# EAGLE board rev1 (EAGLE 9.5.2), part 1 of 2
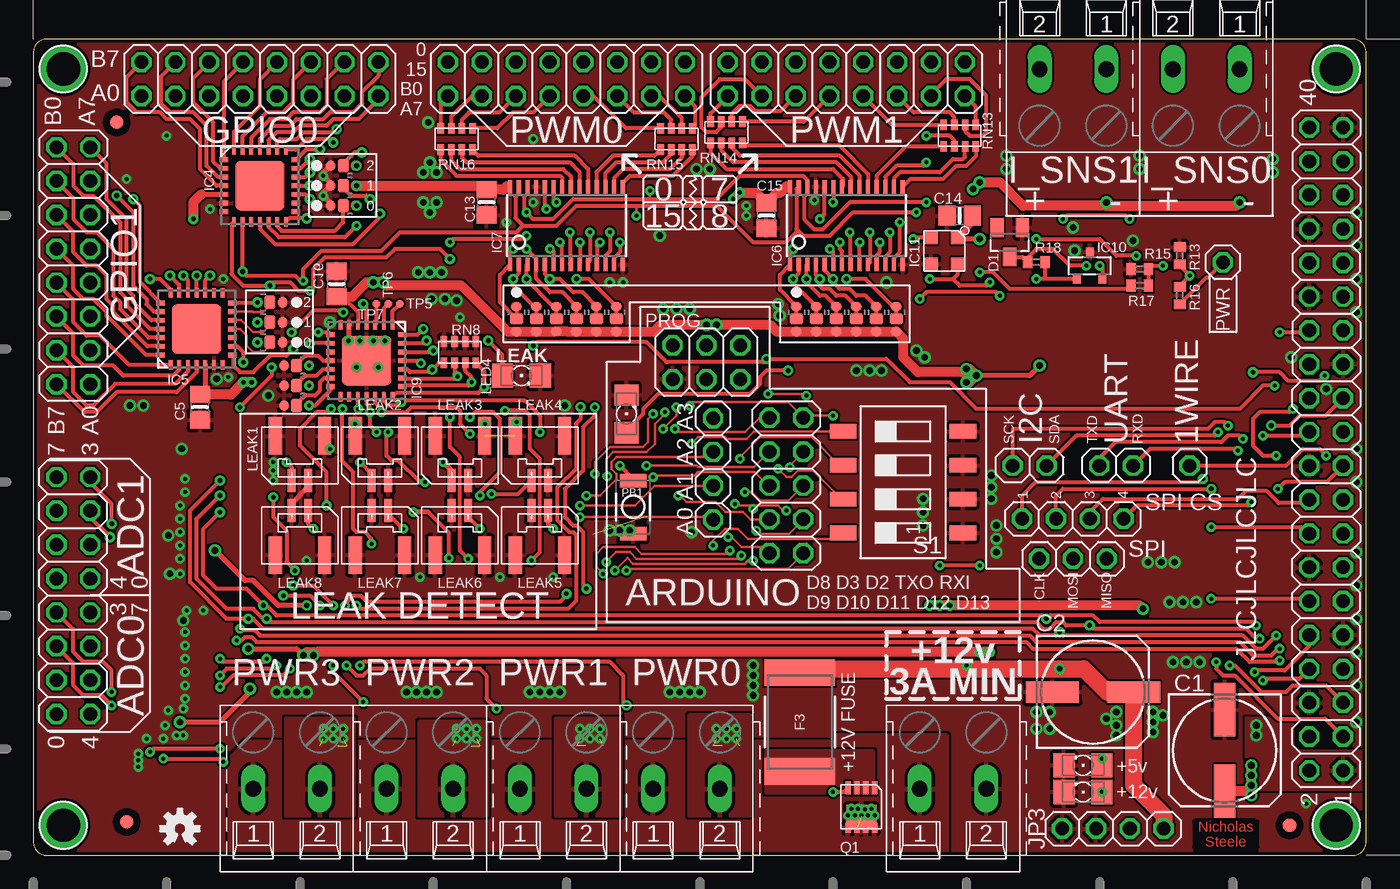
[diagram p5: board, top side]
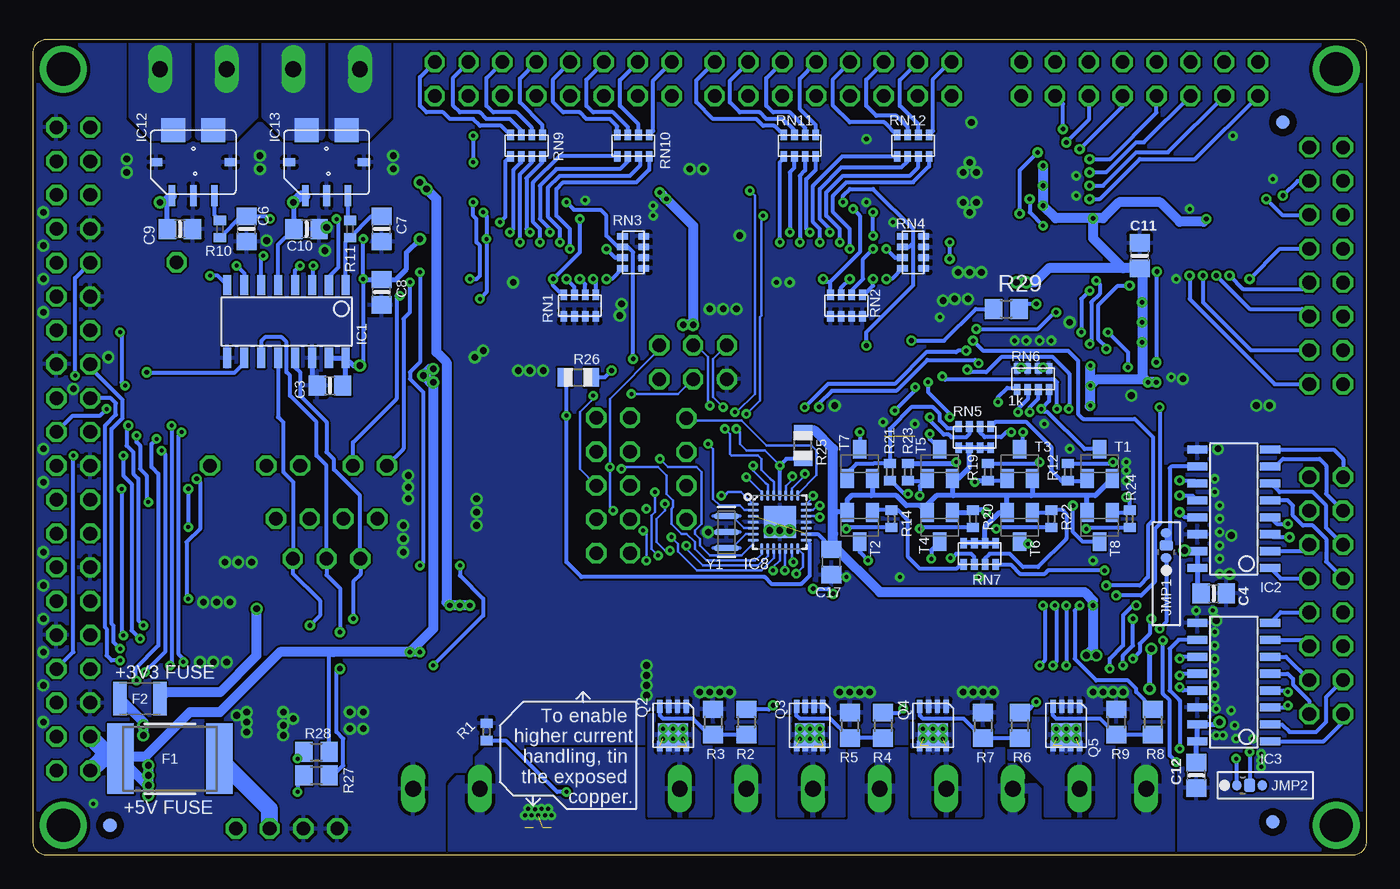
[diagram p6: board, bottom side, seen from below]

Size 100 x 61.25 mm. Coordinates in mm from the lower left corner, seen from the top.
Outline: 0,60.25 0,1 arc90 1,0 99,0 arc90 100,1 100,60.25 arc90 99,61.25 1,61.25 arc90 0,60.25
Copper layers (1*16): Top 0.035mm / dielectric 1.5mm / Bottom 0.035mm
Design rules "default *": minimum track width 6mil, minimum drill 0.3mm, track to track 6mil, track to pad 6mil, pad to pad 6mil, via to via 6mil, smd to smd 6mil, copper to edge 10mil, drill to drill 6mil, minimum pad ring 10mil, minimum via ring 8mil, stop-mask expansion 4mil, vias tented up to drill 20mil, thermal gap 10mil
Net classes: 0 default: width 0.203 mm; 1 vcc: width 0.254 mm
tRestrict: 4 lines

## Footprints (pad centres in the part's own frame; a part is rotated, then mirrored left to right if it is on the bottom)
MOUNTINGHOLE_2.5_PLATED = drill 2.5 pad 3.2: P$1 0,0
153CLV-0807 = smd 4 x 1.6: + 3.05,0; - -3.05,0
0805-NO = smd 1.3 x 1.5: 1 -0.95,0; 2 0.95,0
C0805 = smd 1.3 x 1.5: 1 -0.95,0; 2 0.95,0
SOT23 = smd 1 x 1.4: 1 -0.95,-1.1; 2 0.95,-1.1; 3 0,1.1
2920_(7351_METRIC) = smd 2 x 5.3: 1 -3.7,0; 2 3.7,0
1210_(3225METRIC) = smd 1 x 2.5: 1 -1.5,0; 2 1.5,0
FIDUCIAL_1MM = smd 1 x 1: 1 0,0
MCP3008 = smd 0.61 x 1.524: AGND -1.905,2.667; CH0 -4.445,-2.794; CH1 -3.175,-2.794; CH2 -1.905,-2.794; CH3 -0.635,-2.794; CH4 0.635,-2.794; CH5 1.905,-2.794; CH6 3.175,-2.794; CH7 4.445,-2.794; CLK -0.635,2.667; CS 3.175,2.667; DGND 4.445,2.667; DIN 1.905,2.667; DOUT 0.635,2.667; VDD -4.445,2.667; VREF -3.175,2.667
QFN28-ML_6X6MM = smd 0.7 x 0.35: 1 -2.7,1.95; 2 -2.7,1.3; 3 -2.7,0.65; 4 -2.7,0; 5 -2.7,-0.65; 6 -2.7,-1.3; 7 -2.7,-1.95; 15 2.7,-1.95; 16 2.7,-1.3; 17 2.7,-0.65; 18 2.7,0; 19 2.7,0.65; 20 2.7,1.3; 21 2.7,1.95 | smd 0.35 x 0.7: 8 -1.95,-2.7; 9 -1.3,-2.7; 10 -0.65,-2.7; 11 0,-2.7; 12 0.65,-2.7; 13 1.3,-2.7; 14 1.95,-2.7; 22 1.95,2.7; 23 1.3,2.7; 24 0.65,2.7; 25 0,2.7; 26 -0.65,2.7; 27 -1.3,2.7; 28 -1.95,2.7 | smd 3.7 x 3.7: EXP 0,0
TSSOP28 = smd 0.305 x 0.991: 1 -4.225,-2.918; 2 -3.575,-2.918; 3 -2.925,-2.918; 4 -2.275,-2.918; 5 -1.625,-2.918; 6 -0.975,-2.918; 7 -0.325,-2.918; 8 0.325,-2.918; 9 0.975,-2.918; 10 1.625,-2.918; 11 2.275,-2.918; 12 2.925,-2.918; 13 3.575,-2.918; 14 4.225,-2.918; 15 4.225,2.918; 16 3.575,2.918; 17 2.925,2.918; 18 2.275,2.918; 19 1.625,2.918; 20 0.975,2.918; 21 0.325,2.918; 22 -0.325,2.918; 23 -0.975,2.918; 24 -1.625,2.918; 25 -2.275,2.918; 26 -2.925,2.918; 27 -3.575,2.918; 28 -4.225,2.918
VQFN-28 = smd 0.82 x 0.24: 1 -2,1.35; 2 -2,0.9; 3 -2,0.45; 4 -2,0; 5 -2,-0.45; 6 -2,-0.9; 7 -2,-1.35; 15 2,-1.35; 16 2,-0.9; 17 2,-0.45; 18 2,0; 19 2,0.45; 20 2,0.9; 21 2,1.35 | smd 0.24 x 0.82: 8 -1.35,-2; 9 -0.9,-2; 10 -0.45,-2; 11 0,-2; 12 0.45,-2; 13 0.9,-2; 14 1.35,-2; 22 1.35,2; 23 0.9,2; 24 0.45,2; 25 0,2; 26 -0.45,2; 27 -0.9,2; 28 -1.35,2 | smd 2.4 x 2.4: PAD 0,0
SOT23-R = smd 0.6 x 0.7: 1 -0.95,-1; 2 0.95,-1; 3 0,1
MS5637 = smd 1 x 1: GND 1,-1; SCL 1,1; SDA -1,-1; VDD -1,1
ACS781 = smd 0.5 x 1.6: 1 -1.6,-2.5; 2 0,-2.5; 3 1.6,-2.5 | smd 0.9 x 0.6: 4 2.8,0; 7 -2.8,0 | smd 1.8 x 1.8: 5 1.5,2.4; 6 -1.5,2.4
C0R-JMP = smd 0.8 x 0.7: 1 0,0.938; 3 0,-0.938 | smd 1 x 0.8: 2 0,0
1X02 = drill 1.016 octagon: 1 -1.27,0; 2 1.27,0
1X04 = drill 1.016 octagon: 1 -3.81,0; 2 -1.27,0; 3 1.27,0; 4 3.81,0
1X03 = drill 1.016 octagon: 1 -2.54,0; 2 0,0; 3 2.54,0
2X20 = drill 1.016 octagon: 1 -24.13,-1.27; 2 -24.13,1.27; 3 -21.59,-1.27; 4 -21.59,1.27; 5 -19.05,-1.27; 6 -19.05,1.27; 7 -16.51,-1.27; 8 -16.51,1.27; 9 -13.97,-1.27; 10 -13.97,1.27; 11 -11.43,-1.27; 12 -11.43,1.27; 13 -8.89,-1.27; 14 -8.89,1.27; 15 -6.35,-1.27; 16 -6.35,1.27; 17 -3.81,-1.27; 18 -3.81,1.27; 19 -1.27,-1.27; 20 -1.27,1.27; 21 1.27,-1.27; 22 1.27,1.27; 23 3.81,-1.27; 24 3.81,1.27; 25 6.35,-1.27; 26 6.35,1.27; 27 8.89,-1.27; 28 8.89,1.27; 29 11.43,-1.27; 30 11.43,1.27; 31 13.97,-1.27; 32 13.97,1.27; 33 16.51,-1.27; 34 16.51,1.27; 35 19.05,-1.27; 36 19.05,1.27; 37 21.59,-1.27; 38 21.59,1.27; 39 24.13,-1.27; 40 24.13,1.27
1X01 = drill 1.016 octagon: 1 0,0
2X08 = drill 1.016 octagon: 1 -8.89,-1.27; 2 -8.89,1.27; 3 -6.35,-1.27; 4 -6.35,1.27; 5 -3.81,-1.27; 6 -3.81,1.27; 7 -1.27,-1.27; 8 -1.27,1.27; 9 1.27,-1.27; 10 1.27,1.27; 11 3.81,-1.27; 12 3.81,1.27; 13 6.35,-1.27; 14 6.35,1.27; 15 8.89,-1.27; 16 8.89,1.27
2X03 = drill 1.016 octagon: 1 -2.54,-1.27; 2 -2.54,1.27; 3 0,-1.27; 4 0,1.27; 5 2.54,-1.27; 6 2.54,1.27
2X05 = drill 1.016 octagon: 1 -5.08,-1.27; 2 -5.08,1.27; 3 -2.54,-1.27; 4 -2.54,1.27; 5 0,-1.27; 6 0,1.27; 7 2.54,-1.27; 8 2.54,1.27; 9 5.08,-1.27; 10 5.08,1.27
JST-GH = smd 0.6 x 1.7: 1 0.625,1.875; 2 -0.625,1.875 | smd 1 x 2.8: BASE0 -1.85,-1.475; BASE1 1.85,-1.475
LED_1206 = smd 1.6 x 1.803: A -1.422,0; C 1.422,0
SMD_157SW = smd 1.016 x 1.981: 1 0,0; 2 4,0
POWERPACK_1212-8 = smd 1.727 x 2.235: D0 0.711,0 | smd 0.762 x 0.406: D1 1.549,0.991; D2 1.549,0.33; D3 1.549,-0.33; D4 1.549,-0.991 | smd 0.991 x 0.406: G -1.435,-0.991; S1 -1.435,0.991; S2 -1.435,0.33; S3 -1.435,-0.33
R0402 = smd 0.7 x 0.9: 1 -0.65,0; 2 0.65,0
R0805 = smd 1.3 x 1.5: 1 -0.95,0; 2 0.95,0
R0805' = smd 1.1 x 1.4: 1 -1,0; 2 1,0
0804_RN = smd 0.5 x 0.8: R1A -1.2,0.8; R1B -1.2,-0.8; R2A -0.4,0.8; R2B -0.4,-0.8; R3A 0.4,0.8; R3B 0.4,-0.8; R4A 1.2,0.8; R4B 1.2,-0.8
SMS-004 = smd 1.092 x 2.007: 1 -3.81,-4.496; 2 -1.27,-4.496; 3 1.27,-4.496; 4 3.81,-4.496; 5 3.81,4.496; 6 1.27,4.496; 7 -1.27,4.496; 8 -3.81,4.496
SOT23-BEC = smd 1 x 1.4: B -0.95,-1.1; C 0,1.1; E 0.95,-1.1
TP06R = smd 0.6 x 0.6: TP 0,0
W237-102 = drill 1.194 long: 1 -2.5,0; 2 2.5,0
RESONATOR-SMD-1:1 = smd 0.45 x 1.905: 1 -1.2,0; 2 0,0; 3 1.2,0

## Placement (x,y rotation side)
1  MOUNTINGHOLE2.5  [MOUNTINGHOLE_2.5_PLATED]  2.25,59 0 top
2  MOUNTINGHOLE2.5  [MOUNTINGHOLE_2.5_PLATED]  97.75,59 0 top
3  MOUNTINGHOLE2.5  [MOUNTINGHOLE_2.5_PLATED]  97.75,2.25 0 top
4  MOUNTINGHOLE2.5  [MOUNTINGHOLE_2.5_PLATED]  2.25,2.25 0 top
5  OSHW-LOGOS  [OSHW-LOGO-S]  11,2 0 top
C1  100uF  [153CLV-0807]  89.38,7.88 270 top
C2  100uF  [153CLV-0807]  79.5,12.25 0 top
C3  1uF  [0805-NO]  77.75,35.25 180 bottom
C4  1uF  [0805-NO]  11.45,19.65 0 bottom
C5  1uF  [0805-NO]  12.5,33.62 270 top
C6  1nF  [0805-NO]  84,47 270 bottom
C7  1nF  [0805-NO]  73.88,47 270 bottom
C8  1uF  [0805-NO]  73.88,42.25 270 bottom
C9  .1uF  [0805-NO]  89,47 0 bottom
C10  .1uF  [0805-NO]  79.5,47 0 bottom
C11  10uF  [0805-NO]  17,45 90 bottom
C12  10uF  [0805-NO]  12.75,6 270 bottom
C13  10uF  [0805-NO]  34,49 270 top
C14  1uF  [0805-NO]  69.5,48 180 top
C15  10uF  [0805-NO]  55,48 270 top
C16  10uF  [0805-NO]  22.75,42.88 90 top
C17  0.1uF  [C0805]  40.12,22 90 bottom
D1  BZX84B3V0-7-F  [SOT23]  73.25,46 180 top
F1  3A  [2920_(7351_METRIC)]  89.75,7.25 180 bottom
F2  0.5A  [1210_(3225METRIC)]  92,11.75 180 bottom
F3  3A  [2920_(7351_METRIC)]  57.5,10 90 top
FID1  FIDUCIAL""  [FIDUCIAL_1MM]  94.25,2.25 0 top
FID2  FIDUCIAL""  [FIDUCIAL_1MM]  7,2.5 0 bottom
FID3  FIDUCIAL""  [FIDUCIAL_1MM]  6.25,55 0 top
FID4  FIDUCIAL""  [FIDUCIAL_1MM]  6.25,55 0 bottom
FID5  FIDUCIAL""  [FIDUCIAL_1MM]  94.25,2.25 0 bottom
FID6  FIDUCIAL""  [FIDUCIAL_1MM]  7,2.5 0 top
IC1  U2  [MCP3008]  81,40 180 bottom
IC2  U2  [MCP3008]  10,26 90 bottom
IC3  U2  [MCP3008]  10,13 90 bottom
IC4  MCP23017ML  [QFN28-ML_6X6MM]  17,50.25 0 top
IC5  MCP23017ML  [QFN28-ML_6X6MM]  12.25,39.5 90 top
IC6  PCA9685  [TSSOP28]  61,47.25 0 top
IC7  PCA9685  [TSSOP28]  40,47.25 0 top
IC8  ATMEGA328P_VQFNVQFN  [VQFN-28]  44,25 0 bottom
IC9  MCP23017ML  [QFN28-ML_6X6MM]  25,37.12 270 top
IC10  LM62C  [SOT23-R]  79.25,44.25 0 top
IC11  MS563702BA03-50  [MS5637]  68.35,45.35 270 top
IC12  ACS780LLRTR-050U-T  [ACS781]  88,52 0 bottom
IC13  ACS780LLRTR-050U-T  [ACS781]  78,52 0 bottom
JMP1  0R-JUMPC  [C0R-JMP]  15,23.25 180 bottom
JMP2  0R-JUMPC  [C0R-JMP]  8.75,5.25 90 bottom
JMP3  0R-JUMPC  [C0R-JMP]  57.25,40.25 0 top
JMP4  0R-JUMPC  [C0R-JMP]  58.75,40.25 0 top
JMP5  0R-JUMPC  [C0R-JMP]  60.25,40.25 0 top
JMP6  0R-JUMPC  [C0R-JMP]  61.75,40.25 0 top
JMP7  0R-JUMPC  [C0R-JMP]  63.25,40.25 0 top
JMP8  0R-JUMPC  [C0R-JMP]  64.75,40.25 0 top
JMP9  0R-JUMPC  [C0R-JMP]  36.25,40.25 0 top
JMP10  0R-JUMPC  [C0R-JMP]  37.75,40.25 0 top
JMP11  0R-JUMPC  [C0R-JMP]  39.25,40.25 0 top
JMP12  0R-JUMPC  [C0R-JMP]  40.75,40.25 0 top
JMP13  0R-JUMPC  [C0R-JMP]  42.25,40.25 0 top
JMP14  0R-JUMPC  [C0R-JMP]  43.75,40.25 0 top
JMP15  0R-JUMPC  [C0R-JMP]  23.25,50.25 270 top
JMP16  0R-JUMPC  [C0R-JMP]  17.75,40 90 top
JMP17  0R-JUMPC  [C0R-JMP]  23.25,51.75 270 top
JMP18  0R-JUMPC  [C0R-JMP]  23.25,48.75 270 top
JMP19  0R-JUMPC  [C0R-JMP]  17.75,38.5 90 top
JMP20  0R-JUMPC  [C0R-JMP]  17.75,41.5 90 top
JMP21  0R-JUMPC  [C0R-JMP]  19.75,35.25 270 top
JMP22  0R-JUMPC  [C0R-JMP]  19.75,36.75 270 top
JMP23  0R-JUMPC  [C0R-JMP]  19.75,33.75 270 top
JP1  [1X02]  74.75,29.25 180 top
JP2  [1X02]  81.25,29.25 180 top
JP3  [1X04]  81,2 0 top
JP4  [1X03]  78,22.25 0 top
JP5  [1X04]  78,25.25 180 top
JP6  [2X20]  97,30.5 90 top
JP7  [1X01]  86.75,29.25 0 top
JP8  [2X08]  3,19.5 90 top
JP9  [1X01]  89.25,44.5 270 top
JP10  [2X08]  61,58.25 180 top
JP11  [2X08]  40,58.25 180 top
JP12  [2X08]  17,58.25 180 top
JP13  [2X08]  3,44.25 270 top
JP14  [1X04]  51,29 90 top
JP15  [2X03]  50.5,37 180 top
JP16  [2X05]  56.5,27.75 90 top
LEAK1  JST-GH-2  [JST-GH]  20,30 180 top
LEAK2  JST-GH-2  [JST-GH]  26,30 180 top
LEAK3  JST-GH-2  [JST-GH]  32,30 180 top
LEAK4  JST-GH-2  [JST-GH]  38,30 180 top
LEAK5  JST-GH-2  [JST-GH]  38,24 0 top
LEAK6  JST-GH-2  [JST-GH]  32,24 0 top
LEAK7  JST-GH-2  [JST-GH]  26,24 0 top
LEAK8  JST-GH-2  [JST-GH]  20,24 0 top
LED1  [LED_1206]  44.5,33.12 90 top
LED2  [LED_1206]  78.75,6.75 180 top
LED3  [LED_1206]  78.75,4.75 180 top
LED4  [LED_1206]  36.62,36 0 top
PB1  RESET  [SMD_157SW]  45,24.12 90 top
Q1  1212_PFET  [POWERPACK_1212-8]  62.12,3.62 270 top
Q2  1212_NFET  [POWERPACK_1212-8]  52,9.75 270 bottom
Q3  1212_NFET  [POWERPACK_1212-8]  41.75,9.75 270 bottom
Q4  1212_NFET  [POWERPACK_1212-8]  32.5,9.75 270 bottom
Q5  1212_NFET  [POWERPACK_1212-8]  22.5,9.75 270 bottom
R1  10k  [R0402]  66,9.25 90 bottom
R2  10R  [R0805]  46.5,10 270 bottom
R3  10k  [R0805]  49,10 270 bottom
R4  10R  [R0805]  36.25,9.75 270 bottom
R5  10k  [R0805]  38.75,9.75 270 bottom
R6  10R  [R0805]  26,9.75 270 bottom
R7  10k  [R0805]  28.75,9.75 270 bottom
R8  10R  [R0805]  16,10 270 bottom
R9  10k  [R0805]  18.75,10 270 bottom
R10  10k  [R0402]  86,47 270 bottom
R11  10k  [R0402]  76.25,47 270 bottom
R12  1k  [R0402]  22.38,28.75 90 bottom
R13  1k  [R0402]  86,45 270 top
R14  1k  [R0402]  35.62,25.25 270 bottom
R15  1k  [R0402]  83,44 0 top
R16  11k  [R0402]  86,42 270 top
R17  2.2k  [R0402]  83,42.75 180 top
R18  400R  [R0402]  75.25,44.5 180 top
R19  1k  [R0402]  28.38,28.75 90 bottom
R20  1k  [R0402]  29.5,25.25 270 bottom
R21  1k  [R0402]  34.38,28.75 90 bottom
R22  1k  [R0402]  23.62,25.25 270 bottom
R23  1k  [R0402]  35.75,28.75 270 bottom
R24  1k  [R0402]  17.75,25.25 270 bottom
R25  10K  [R0805']  42.25,30.75 90 bottom
R26  1k  [R0805']  59.12,35.88 0 bottom
R27  1k  [R0805]  78.75,7.75 0 bottom
R28  1k  [R0805]  78.75,6 0 bottom
R29  1k  [R0805]  27,41 0 bottom
RN1  10k  [0804_RN]  59,41.25 0 bottom
RN2  10k  [0804_RN]  39,41.25 0 bottom
RN3  10k  [0804_RN]  55,45.25 90 bottom
RN4  10k  [0804_RN]  34,45.25 90 bottom
RN5  27k  [0804_RN]  29.38,31.38 0 bottom
RN6  1k  [0804_RN]  25,35.75 0 bottom
RN7  27k  [0804_RN]  29,22.62 180 bottom
RN8  1k  [0804_RN]  32,37.75 0 top
RN9  220R  [0804_RN]  63,53.25 0 bottom
RN10  220R  [0804_RN]  55,53.25 0 bottom
RN11  220R  [0804_RN]  42.5,53.25 0 bottom
RN12  220R  [0804_RN]  34,53.25 0 bottom
RN13  220R  [0804_RN]  69.5,54 0 top
RN14  220R  [0804_RN]  52,54.25 0 top
RN15  220R  [0804_RN]  48.25,53.75 0 top
RN16  220R  [0804_RN]  31.75,53.75 0 top
S1  SWS004  [SMS-004]  65.25,28 90 top
T1  MMBT3906  [SOT23-BEC]  20,29.38 0 bottom
T2  [SOT23-BEC]  38,24.62 180 bottom
T3  [SOT23-BEC]  26,29.38 0 bottom
T4  [SOT23-BEC]  32,24.62 180 bottom
T5  [SOT23-BEC]  32,29.38 0 bottom
T6  [SOT23-BEC]  26,24.62 180 bottom
T7  [SOT23-BEC]  38,29.38 0 bottom
T8  [SOT23-BEC]  20,24.62 180 bottom
TP5  PTR1TP06R  [TP06R]  27.5,41.38 0 top
TP6  PTR1TP06R  [TP06R]  26.62,41.38 0 top
TP7  PTR1TP06R  [TP06R]  25.75,41.38 0 top
X1  [W237-102]  69,5 0 top
X2  [W237-102]  49,5 0 top
X3  [W237-102]  39,5 0 top
X4  [W237-102]  29,5 0 top
X5  [W237-102]  19,5 0 top
X6  [W237-102]  88,59 180 top
X7  [W237-102]  78,59 180 top
Y1  8/16/20MHz  [RESONATOR-SMD-1:1]  48,24.25 270 bottom